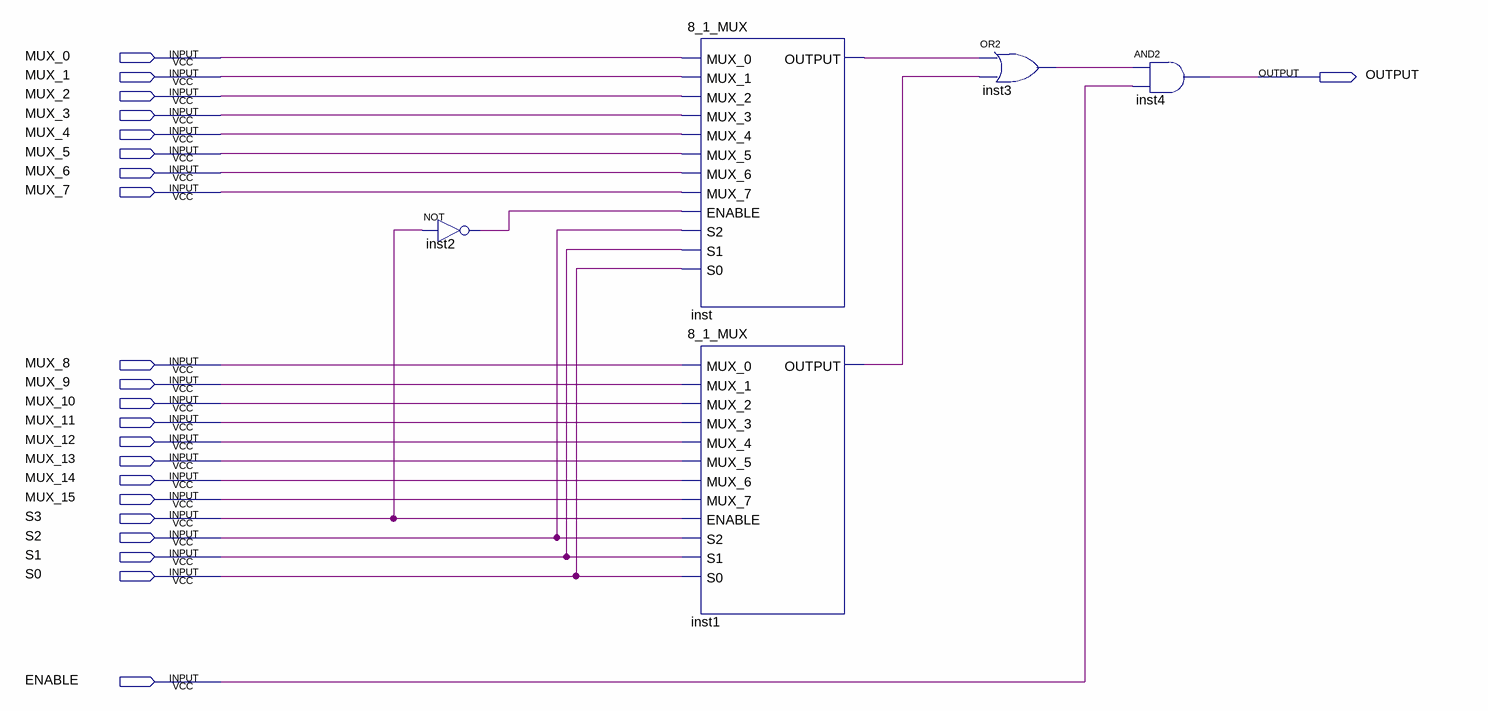
[diagram p0: schematic sheet]
// Quartus schematic 16_1_MUX.bdf as structural Verilog: 5 symbols, 22 pins
module \16_1_MUX  (
  input  MUX_0,
  input  MUX_1,
  input  MUX_2,
  input  MUX_3,
  input  MUX_4,
  input  MUX_5,
  input  MUX_6,
  input  MUX_7,
  input  MUX_8,
  input  MUX_9,
  input  MUX_10,
  input  MUX_11,
  input  MUX_12,
  input  MUX_13,
  input  MUX_14,
  input  MUX_15,
  input  S3,
  input  S2,
  input  S1,
  input  S0,
  input  ENABLE,
  output OUTPUT
);

  wire inst1_output, inst2_out, inst3_out, inst_output;

  not inst2 (inst2_out, S3);
  \8_1_MUX  inst (
    .MUX_0(MUX_0), .MUX_1(MUX_1), .MUX_2(MUX_2), .MUX_3(MUX_3), .MUX_4(MUX_4), .MUX_5(MUX_5), .MUX_6(MUX_6),
    .MUX_7(MUX_7), .ENABLE(inst2_out), .S2(S2), .S1(S1), .S0(S0), .OUTPUT(inst_output));
  \8_1_MUX  inst1 (
    .MUX_0(MUX_8), .MUX_1(MUX_9), .MUX_2(MUX_10), .MUX_3(MUX_11), .MUX_4(MUX_12), .MUX_5(MUX_13),
    .MUX_6(MUX_14), .MUX_7(MUX_15), .ENABLE(S3), .S2(S2), .S1(S1), .S0(S0), .OUTPUT(inst1_output));
  or inst3 (inst3_out, inst_output, inst1_output);
  and inst4 (OUTPUT, inst3_out, ENABLE);
endmodule
